# Altium schematic sheet main.SchDoc
size A4; Author: Mikołaj Pichita; CompanyName: AGH University of Science and Technology; SheetNumber: 2; SheetTotal: 16
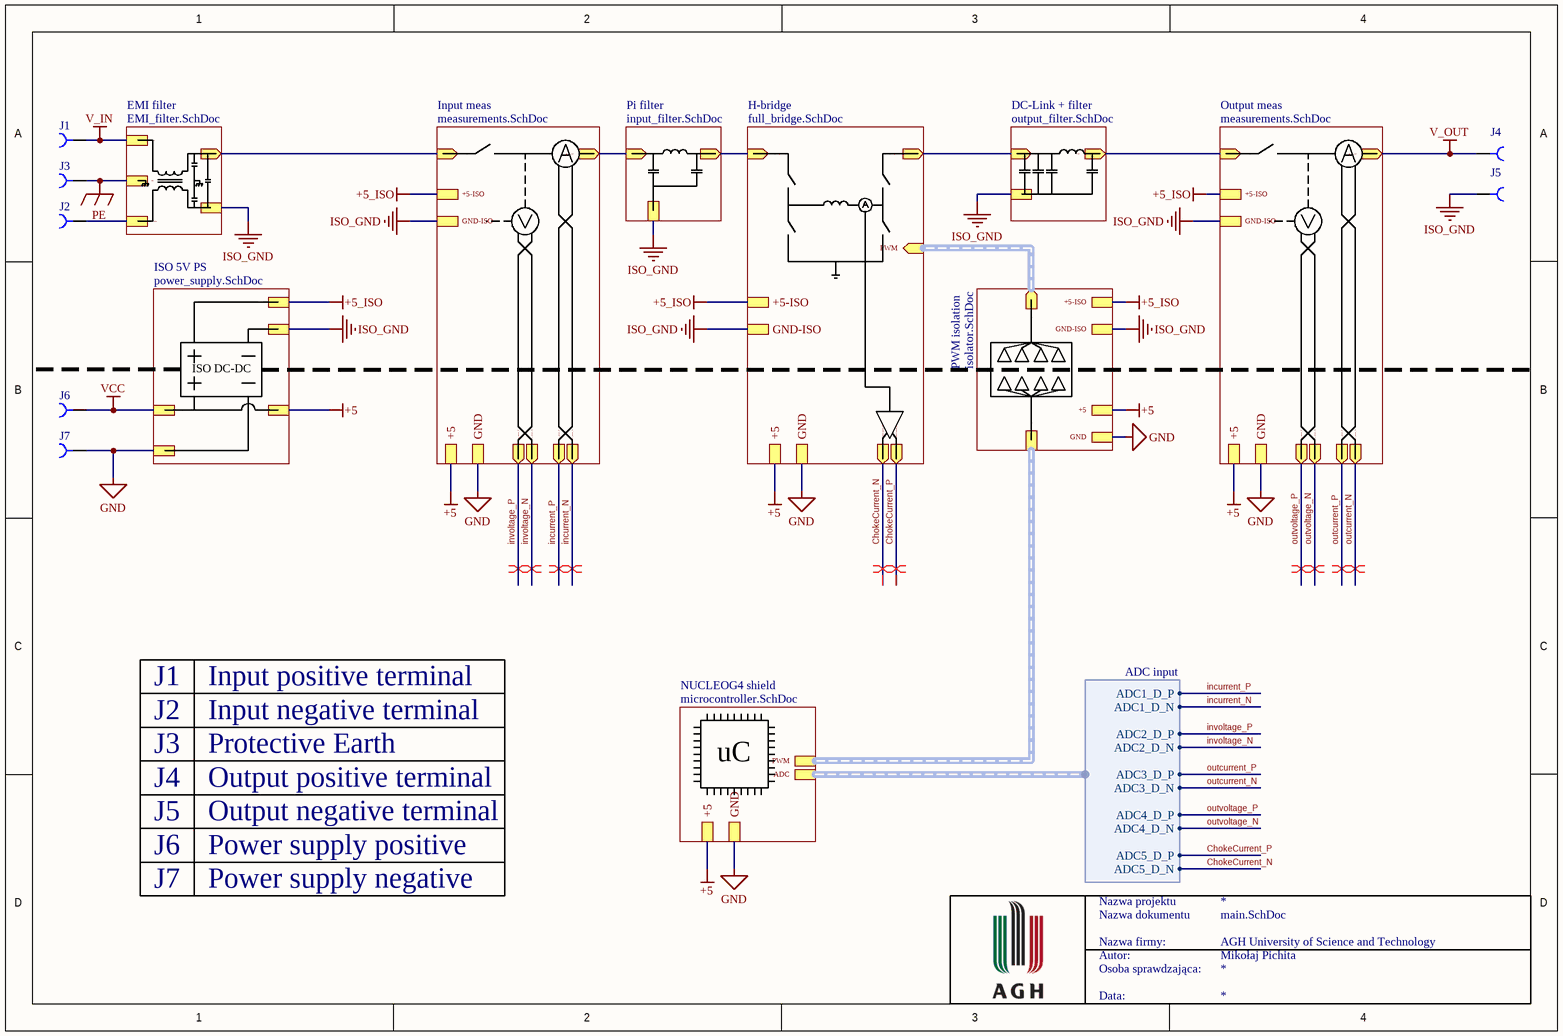
[diagram p0: main.SchDoc]

## Parts
J1  RED  [571-0X00]  (value not drawn)
J2  BLACK  [571-0X00]  (value not drawn)
J3  GREEN  [571-0X00]  (value not drawn)
J4  RED  [571-0X00]  (value not drawn)
J5  BLACK  [571-0X00]  (value not drawn)
J6  RED  [571-0X00]  (value not drawn)
J7  BLACK  [571-0X00]  (value not drawn)

## Sub-sheets
DC-Link + filter = output_filter.SchDoc: In (in), Out (out), GND-ISO
EMI filter = EMI_filter.SchDoc: Line, Return, NEG, POS (out), PE
H-bridge = full_bridge.SchDoc: Hi_side_in (in), Hi_side_out (out), PWM (in, harness Isolated PWM), ChokeCurrent_P (out), ChokeCurrent_N (out), +5-ISO, GND-ISO, +5, GND
Input meas = measurements.SchDoc: vs_meas_P (out), vs_meas_N (out), cs_meas_P (out), cs_meas_N (out), +5, GND, meas_in (in), meas_out (out), GND-ISO, +5-ISO
ISO 5V PS = power_supply.SchDoc: Vcc_in, +5, +5-ISO, GND, GND-ISO
NUCLEOG4 shield = microcontroller.SchDoc: PWM (harness Non isolated PWM), ADC (harness ADC input), +5, GND
Output meas = measurements.SchDoc: vs_meas_P (out), vs_meas_N (out), cs_meas_P (out), cs_meas_N (out), +5, GND, meas_in (in), meas_out (out), GND-ISO, +5-ISO
Pi filter = input_filter.SchDoc: In (in), Out (out), GND-ISO
PWM isolation = isolator.SchDoc: iso_out (out, harness Isolated PWM), iso_in (harness Non isolated PWM), +5-ISO, GND-ISO, +5, GND

## Harnesses
ADC input: ADC1_D_N, ADC1_D_P, ADC2_D_N, ADC2_D_P, ADC3_D_N, ADC3_D_P, ADC4_D_N, ADC4_D_P, ADC5_D_P, ADC5_D_N

## Nets
+5: sheet Output meas/+5, sheet Input meas/+5, sheet H-bridge/+5, sheet ISO 5V PS/+5, sheet PWM isolation/+5, sheet NUCLEOG4 shield/+5
+5_ISO: sheet Output meas/+5-ISO, sheet Input meas/+5-ISO, sheet H-bridge/+5-ISO, sheet ISO 5V PS/+5-ISO, sheet PWM isolation/+5-ISO
GND: J7.1 ; sheet Output meas/GND, sheet Input meas/GND, sheet H-bridge/GND, sheet ISO 5V PS/GND, sheet PWM isolation/GND, sheet NUCLEOG4 shield/GND
ISO_GND: J5.1 ; sheet Output meas/GND-ISO, sheet Input meas/GND-ISO, sheet Pi filter/GND-ISO, sheet H-bridge/GND-ISO, sheet DC-Link + filter/GND-ISO, sheet ISO 5V PS/GND-ISO, sheet PWM isolation/GND-ISO, sheet EMI filter/NEG
PE: J3.1 ; sheet EMI filter/PE
V_IN: J1.1 ; sheet EMI filter/Line
V_OUT: J4.1 ; sheet Output meas/meas_out
VCC: J6.1 ; sheet ISO 5V PS/Vcc_in
ChokeCurrent_N: sheet H-bridge/ChokeCurrent_N, sheet NUCLEOG4 shield/ADC.ADC5_D_N
ChokeCurrent_P: sheet H-bridge/ChokeCurrent_P, sheet NUCLEOG4 shield/ADC.ADC5_D_P
incurrent_N: sheet Input meas/cs_meas_N, sheet NUCLEOG4 shield/ADC.ADC1_D_N
incurrent_P: sheet Input meas/cs_meas_P, sheet NUCLEOG4 shield/ADC.ADC1_D_P
involtage_N: sheet Input meas/vs_meas_N, sheet NUCLEOG4 shield/ADC.ADC2_D_N
involtage_P: sheet Input meas/vs_meas_P, sheet NUCLEOG4 shield/ADC.ADC2_D_P
outcurrent_N: sheet Output meas/cs_meas_N, sheet NUCLEOG4 shield/ADC.ADC3_D_N
outcurrent_P: sheet Output meas/cs_meas_P, sheet NUCLEOG4 shield/ADC.ADC3_D_P
outvoltage_N: sheet Output meas/vs_meas_N, sheet NUCLEOG4 shield/ADC.ADC4_D_N
outvoltage_P: sheet Output meas/vs_meas_P, sheet NUCLEOG4 shield/ADC.ADC4_D_P
NetJ2_1: J2.1 ; sheet EMI filter/Return
(unnamed): sheet Output meas/meas_in, sheet DC-Link + filter/Out
(unnamed): sheet Input meas/meas_in, sheet EMI filter/POS
(unnamed): sheet Input meas/meas_out, sheet Pi filter/In
(unnamed): sheet Pi filter/Out, sheet H-bridge/Hi_side_in
(unnamed): sheet H-bridge/Hi_side_out, sheet DC-Link + filter/In

## Buses and harness runs
harness sheet H-bridge/PWM = sheet PWM isolation/iso_out
harness sheet NUCLEOG4 shield/PWM = sheet PWM isolation/iso_in

## Layout directives
differential pair: ChokeCurrent_N, ChokeCurrent_P, incurrent_N, incurrent_P, involtage_N, involtage_P, outcurrent_N, outcurrent_P, outvoltage_N, outvoltage_P

## Notes on the sheet
- ISO DC-DC
- J1
- Input positive terminal
- J2
- J3
- J4
- Input negative terminal
- Protective Earth
- Output positive terminal
- uC
- J5
- Output negative terminal
- J6
- J7
- Power supply positive
- Power supply negative
- Nazwa projektu
- Nazwa dokumentu
- Nazwa firmy:
- Autor:
- Osoba sprawdzająca:
- Data:

## Library data of the parts
J1-J7 = Banana connector: Value: *; HelpURL: *; MPN: *; Supplier: *; SupplierPartNumber: *